# Altium schematic sheet JWpulsegen-V3.SchDoc
size A3
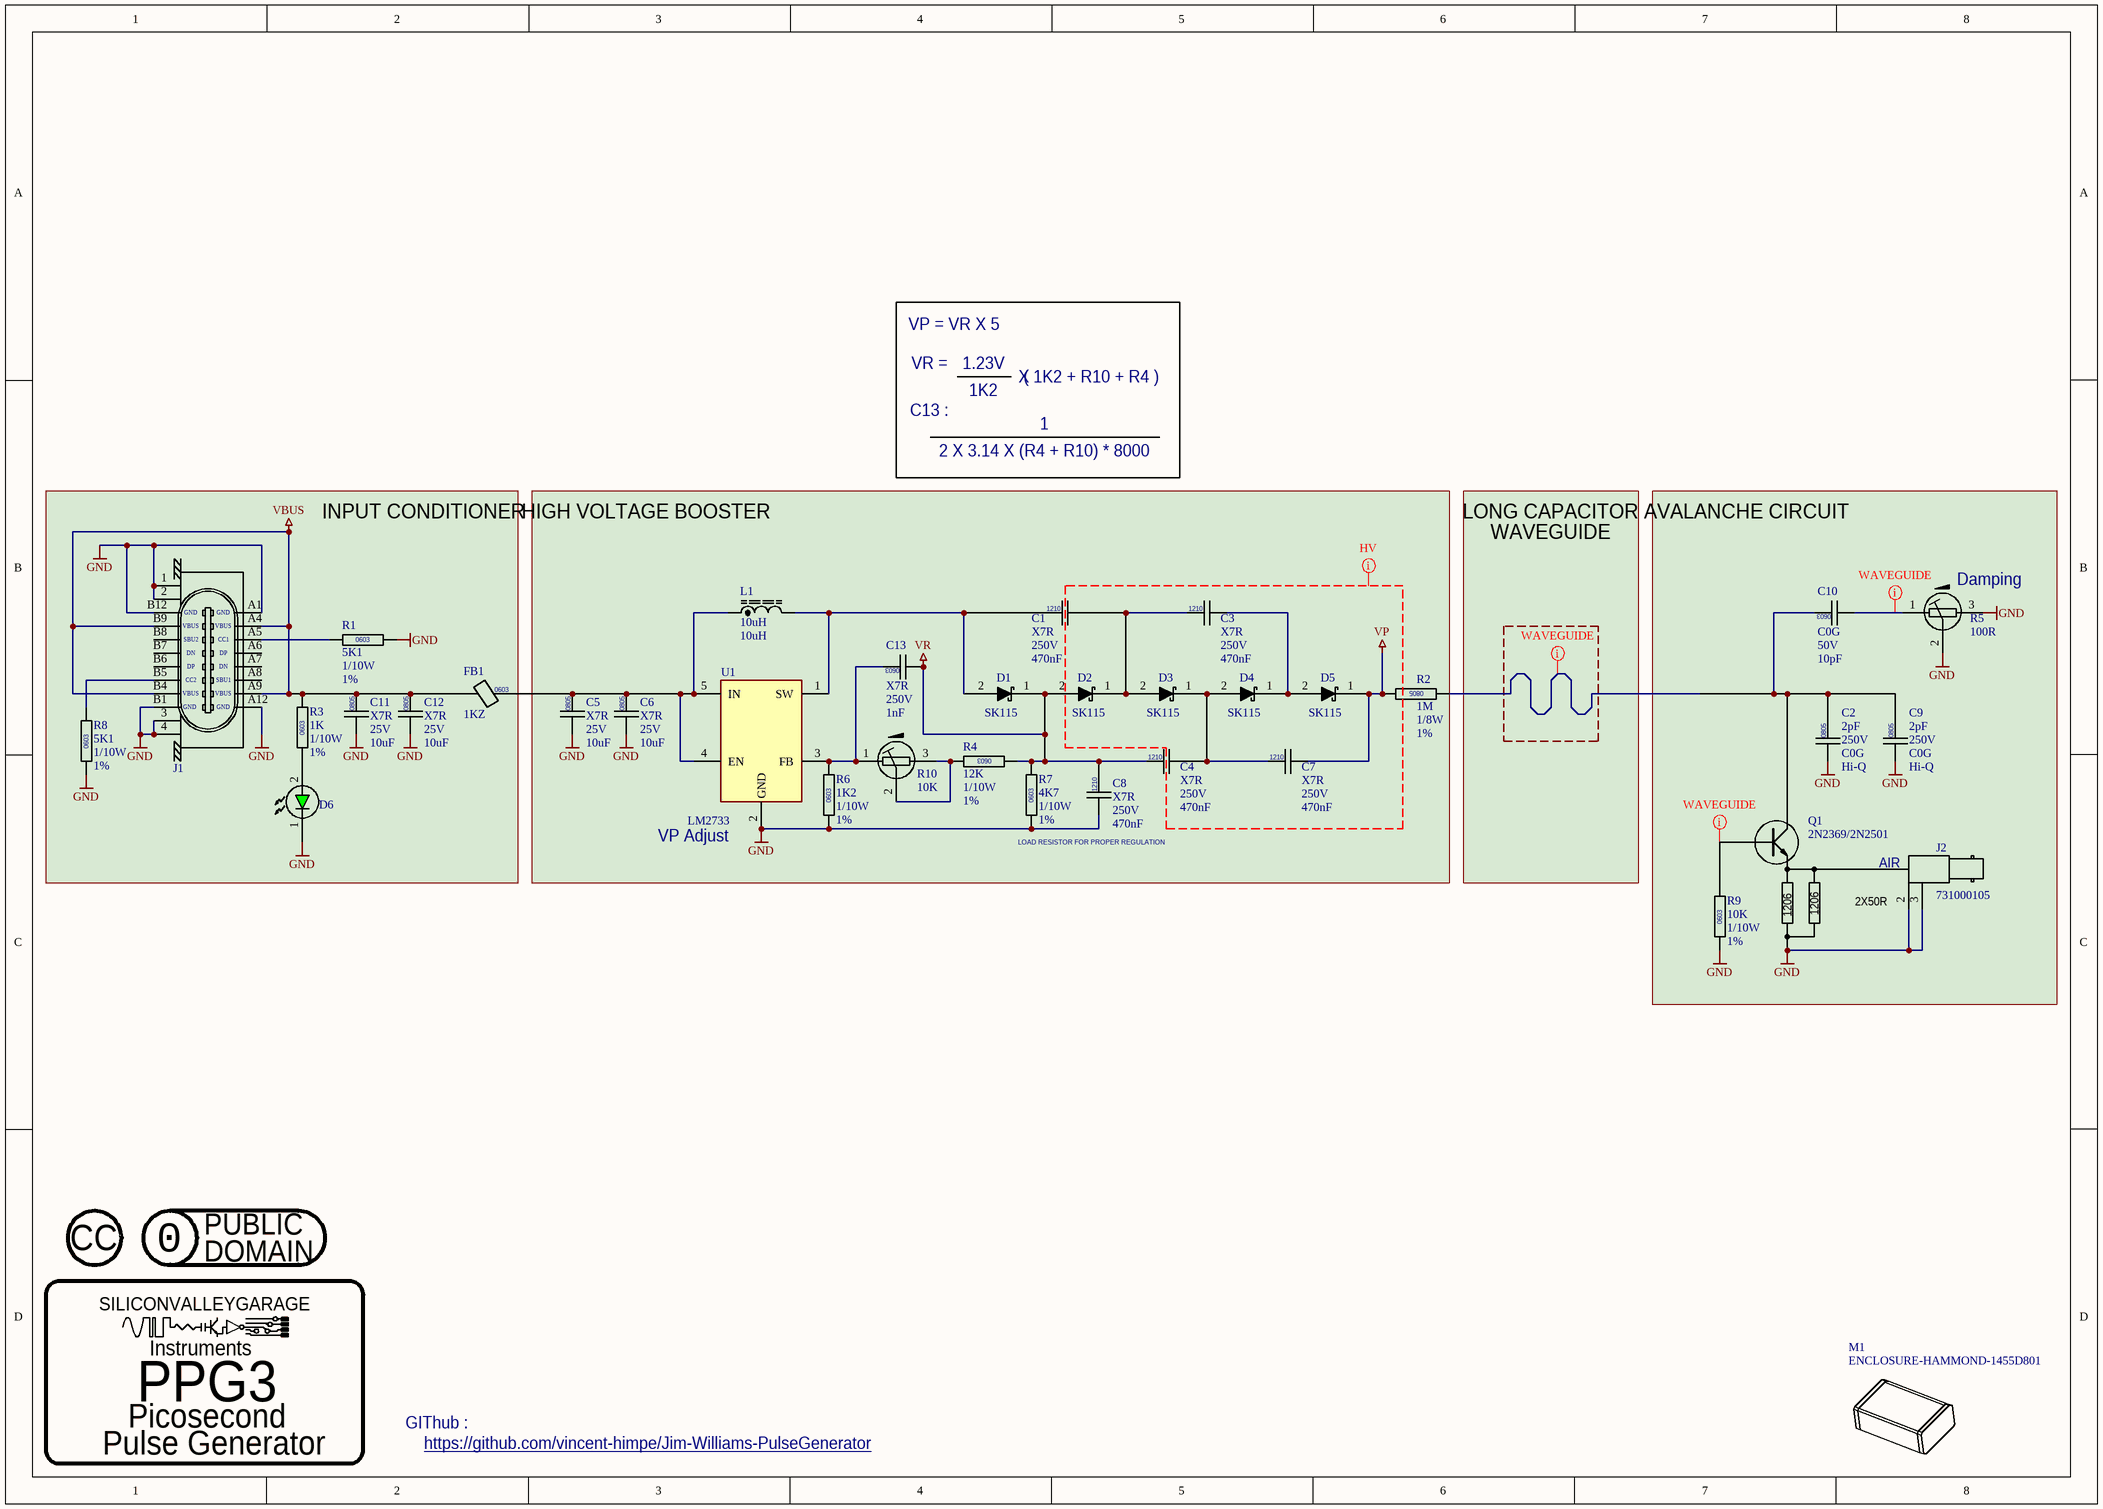
[diagram p0: JWpulsegen-V3.SchDoc]

## Parts
(Parts that share a designator on the sheet are numbered #1, #2 ... from top to bottom, then left to right.)
C1  Dielectric: X7R  Voltage: 250V  Capacitance: 470nF  [CAPC1210]  (hidden comment: CAPC-1210-470nF-250V-X7R)
C2  SPECIAL: Hi-Q  Dielectric: C0G  Voltage: 250V  Capacitance: 2pF  [CAPC0805]  (hidden comment: CAP0805)
C3  Dielectric: X7R  Voltage: 250V  Capacitance: 470nF  [CAPC1210]  (hidden comment: CAPC-1210-470nF-250V-X7R)
C4  Dielectric: X7R  Voltage: 250V  Capacitance: 470nF  [CAPC1210]  (hidden comment: CAPC-1210-470nF-250V-X7R)
C5  Dielectric: X7R  Voltage: 25V  Capacitance: 10uF  [CAPC0805]  (hidden comment: CAP0805)
C6  Dielectric: X7R  Voltage: 25V  Capacitance: 10uF  [CAPC0805]  (hidden comment: CAP0805)
C7  Dielectric: X7R  Voltage: 250V  Capacitance: 470nF  [CAPC1210]  (hidden comment: CAPC-1210-470nF-250V-X7R)
C8  Dielectric: X7R  Voltage: 250V  Capacitance: 470nF  [CAPC1210]  (hidden comment: CAPC-1210-470nF-250V-X7R)
C9  SPECIAL: Hi-Q  Dielectric: C0G  Voltage: 250V  Capacitance: 2pF  [CAPC0805]  (hidden comment: CAP0805)
C10  Dielectric: C0G  Voltage: 50V  Capacitance: 10pF  [CAPC0603]  (hidden comment: CAP0603)
C11  Dielectric: X7R  Voltage: 25V  Capacitance: 10uF  [CAPC0805]  (hidden comment: CAP0805)
C12  Dielectric: X7R  Voltage: 25V  Capacitance: 10uF  [CAPC0805]  (hidden comment: CAP0805)
C13  Dielectric: X7R  Voltage: 250V  Capacitance: 1nF  [CAPC0603]  (hidden comment: CAP0603)
D1  SK115  [DO214AC]
D2  SK115  [DO214AC]
D3  SK115  [DO214AC]
D4  SK115  [DO214AC]
D5  SK115  [DO214AC]
D6  LED-3MM-GREEN  [LED-3MM-GREEN]  (value not drawn)
FB1  value 1KZ  [FB0603]  (hidden comment: FB0603)
J1  CONN-USBC-USB2-HOR  [CONN-GCT-USB4085]  (value not drawn)
J2  731000105  [CONN-MOLEX-7310000105]
L1  10uH  [IND-MURATA-LQH3NPZ]
LOGO?#1  LOGO-LICENSE-CC  [LOGO-LICENSE-CC]  (value not drawn)  (no BOM)
LOGO?#2  LOGO-LICENSE-CC0-PUBLIC  [LOGO-LICENSE-CC0-PUBLIC]  (value not drawn)  (no BOM)
LOGO?#3  LOGO-SILICONVALLEYGARAGE-SMALL  [SILICONVALLEYGARAGE]  (value not drawn)  (graphical)
M1  ENCLOSURE-HAMMOND-1455D801  (mechanical)
Q1  2N2369/2N2501  [SPECIAL-2N2369-JW]
R1  value 5K1  Power: 1/10W  Tolerance: 1%  [RESC0603]  (hidden comment: RESC0603)
R2  value 1M  Power: 1/8W  Tolerance: 1%  [RESC0805]  (hidden comment: RESC0805)
R3  value 1K  Power: 1/10W  Tolerance: 1%  [RESC0603]  (hidden comment: RESC0603)
R4  value 12K  Power: 1/10W  Tolerance: 1%  [RESC0603]  (hidden comment: RESC0603)
R5  value 100R  [TRIMMER-BOURNS-TC33]  (hidden comment: TRIMMER-BOURNS-TC33X-2-101E)
R6  value 1K2  Power: 1/10W  Tolerance: 1%  [RESC0603]  (hidden comment: RESC0603)
R7  value 4K7  Power: 1/10W  Tolerance: 1%  [RESC0603]  (hidden comment: RESC0603)
R8  value 5K1  Power: 1/10W  Tolerance: 1%  [RESC0603]  (hidden comment: RESC0603)
R9  value 10K  Power: 1/10W  Tolerance: 1%  [RESC0603]  (hidden comment: RESC0603)
R10  value 10K  [TRIMMER-BOURNS-TC33]  (hidden comment: TRIMMER-BOURNS-TC33X-2-103G)
U1  LM2733  [SOT23-5]

## Blocks framed on the sheet
INPUT CONDITIONER: C11 C12 D6 FB1 J1 R1 R3 R8
HIGH VOLTAGE BOOSTER: C1 C3-C8 C13 D1-D5 L1 R2 R4 R6 R7 R10 U1
AVALANCHE CIRCUIT: C2 C9 C10 J2 Q1 R5 R9
PPG3: LOGO?#3

## Nets
GND: C2.2 C5.2 C6.2 C8.2 C9.2 C11.2 C12.2 D6.1(A) J1.1 J1.2 J1.3 J1.4 J1.A1 J1.A12 J1.B1 J1.B12 J2.2(VIN) J2.3(VIN) Q1.G R1.1 R5.2 R5.3 R6.2 R7.2 R8.2 R9.2 U1.2(GND)
VBUS: C11.1 C12.1 FB1.2 J1.A4 J1.A9 J1.B4 J1.B9 R3.1
VP: C7.2 D5.1(K) R2.1
VR: C4.1 C8.1 C13.2 D1.1(K) D2.2(A) R4.2 R7.1
NetC1_1: C1.1 D1.2(A) L1.2 U1.1(SW)
NetC1_2: C1.2 C3.1 D2.1(K) D3.2(A)
NetC2_1: C2.1 C9.1 C10.1 Q1.C R2.2
NetC3_2: C3.2 D4.1(K) D5.2(A)
NetC4_2: C4.2 C7.1 D3.1(K) D4.2(A)
NetC5_1: C5.1 C6.1 FB1.1 L1.1 U1.4(EN) U1.5(IN)
NetC10_2: C10.2 R5.1
NetC13_1: C13.1 R6.1 R10.1 U1.3(FB)
NetD6_2: D6.2(K) R3.2
NetJ1_A5: J1.A5 R1.2
NetJ1_B5: J1.B5 R8.1
NetQ1_B: Q1.B R9.1
NetR4_1: R4.1 R10.2 R10.3

Not connected (* = marked no-connect by the designer): J1 A6 A7 A8 B6 B7 B8

## Layout directives
net class WAVEGUIDE: NetC2_1, NetC10_2, NetQ1_B
net class HV: VP

## Notes on the sheet
- VR =
- VP = VR X 5
- 1.23V
- X
- ( 1K2 + R10 + R4 )
- C13 :
- 1K2
- 1
- 2 X 3.14 X (R4 + R10) * 8000
- LONG CAPACITOR
- WAVEGUIDE
- (near R5) Damping
- (near U1) VP Adjust
- LOAD RESISTOR FOR PROPER REGULATION
- (near LOGO?#3) Instruments
- Picosecond
- Pulse Generator
- https://github.com/vincent-himpe/Jim-Williams-PulseGenerator
- GIThub :
- (in symbol CAPC-0805-2pF-250V-C0G-HIQ) 0805
- (in symbol CAPC-0805-10uF-25V) 0805
- (in symbol CAPC-1210-470nF-250V-X7R) 1210
- (in symbol CONN-MOLEX-7310000105) AIR
- (in symbol CONN-USBC-USB2-HOR) GND; VBUS; SBU2; CC1; DN; DP; CC2; SBU1
- (in symbol FB0603-1KZ-0R2) 0603
- (in symbol LOGO-LICENSE-CC) CC
- (in symbol LOGO-LICENSE-CC0-PUBLIC) PUBLIC; 0; DOMAIN
- (in symbol LOGO-SILICONVALLEYGARAGE-SMALL) SILICONVALLEYGARAGE
- (in symbol RESC-0603-1K2-1%-1/10W) 0603
- (in symbol RESC-0603-1K-1%-1/10W) 0603
- (in symbol RESC-0603-4K7-1%-1/10W) 0603
- (in symbol RESC-0603-5K1-1%-1/10W) 0603
- (in symbol RESC-0603-10K-1%-1/10W) 0603
- (in symbol RESC-0603-12K-1%-1/10W) 0603
- (in symbol RESC-0805-1M-1%-1/8W_1) 0805
- (in symbol SPECIAL-2N2369-JW) 1206; 2X50R

## Library data of the parts
C1 C3 C4 C7 C8 = CAPC-1210-470nF-250V-X7R: CAPACITOR,CERAMIC,470nF,250V,X7R,1210; Manufacturer 1: WALSIN; Manufacturer Part Number 1: SH43B474K251CT; Package / Case: 1210 (3225 METRIC); Location: *; Supplier 1: Mouser; Supplier Part Number 1: 80-C1210C474KARACTU; Supplier 2: Digikey; Supplier Part Number 2: 4587-C1210X474K251TCT-ND; Supplier 3: Digikey; Supplier Part Number 3: 4713-CHV1210N250474KXTCT-ND; Supplier 4: Mouser; Supplier Part Number 4: 80-C1210C474KARAUTO; Supplier 5: Mouser; Supplier Part Number 5: 80-C1210X474KARAUTO; MOUSER: 791-SH43B474K251CT
C2 C9 = CAPC-0805-2pF-250V-C0G-HIQ: CAPACITOR,CERAMIC,2pF,250V,C0G,0805,HIQ; Manufacturer 1: JOHANSON; Manufacturer Part Number 1: 251R15S2R0AV4E; Package / Case: 0805 (2012 metric); Location: *; MOUSER: 609-251R15S2R0AV4E
C5 C6 C11 C12 = CAPC-0805-10uF-25V: CAPACITOR,CERAMIC,10uF,25V,X5R,0805; Manufacturer 1: SAMSUNG; Manufacturer Part Number 1: CL21B106KAYQNNE; Package / Case: 0805 (2012 metric); Location: *; LCSC: C3039694; MOUSER: 187-CL21B106KAYQNNE
C10 = CAPC-0603-10PF-50V-C0G: CAPACITOR,CERAMIC,10pF,50V,C0G,0603; Manufacturer 1: KYOCERA; Manufacturer Part Number 1: C0603C100J5GAC; Package / Case: 0603; Location: *; MOUSER: 80-C0603C100J5GAC
C13 = CAPC-0603-1nF-250V-X7R: CAPACITOR,CERAMIC,1nF,250V,X7R,0603; Manufacturer 1: YAGEO; Manufacturer Part Number 1: CC0603KRX7RYBB102; Package / Case: 0603; Location: *; LCSC: C277510; Supplier 1: Digikey; Supplier Part Number 1: 311-4104-1-ND; MOUSER: 603-CC0603KRYBB102
D1-D5 = DIODE-SCHOTTKY-DIOTEC-SK115: DIODE,SCHOTTKY,150V,1A,SK115,DO214AC(SMA); Manufacturer 1: DIOTEC; DIGIKEY: 2796-SK115TR-ND; Manufacturer Part Number 1: SK115; MOUSER: 637-SK115
D6 = LED-3MM-GREEN: LED,TH,GREEN,42mCd,3MM; Manufacturer 1: WURTH; Manufacturer Part Number 1: 151031VS06000; MOUSER: 78-VLMPG33N1P2; Supplier 1: Mouser; Supplier Part Number 1: 78-VLMPG33N1P2
FB1 = FB0603-1KZ-0R2: FERRITE,1KZ@100MHz,0R2DC,0603; Manufacturer 1: MURATA; Manufacturer Part Number 1: BLM18KG102SN1D; LCSC: C160982; Supplier 1: Arrow Electronics; Supplier Part Number 1: BLM18KG102SN1D; MOUSER: 81-BLM18KG102SN1D
J1 = CONN-USBC-USB2-HOR: CONN,USB-C,16P,RA,TH,8.94X9.17; Manufacturer 1: GCT; Manufacturer Part Number 1: USB4085-GF-A; Supplier 1: Digikey; Supplier Part Number 1: 2073-USB4085-GF-ACT-ND; LCSC: C7095263; MOUSER: 640-USB4085-GF-A
J2 = CONN-MOLEX-7310000105: CONN,BNC,RA; Manufacturer 1: MOLEX; Manufacturer Part Number 1: 731000-0105; DIGIKEY: WM5524-ND; MOUSER: 538-73100-0105
L1 = IND-MURATA-LQH3NPZ100MMEL: IND,10uH,1.2A,3X3, LQH3NPZ100MMEL; Manufacturer 1: MURATA; LCSC: C701168; Supplier 1: Arrow Electronics; Supplier Part Number 1: LQH3NPZ100MMEL; VALUE: 10uH; Manufacturer Part Number 1: LQH3NPZ100MMEL; MOUSER: 81-LQH3NPZ100MMEL
LOGO?#3 = LOGO-SILICONVALLEYGARAGE-SMALL: LOGO,SILICONVALLEYGARAGE,SMALL
M1 = ENCLOSURE-HAMMOND-1455D801: ENCLOSURE,ALU.EXTRUDED,3.2inX1.8inX0.99in; Manufacturer 1: HAMMOND MANUFACTURING; Manufacturer Part Number 1: 1455D801; MOUSER: 546-1455D801
Q1 = SPECIAL-2N2369-JW: TRANSISTOR, 2N2369 OR 2N2501, GOLD PINS, NOT 'A' VERSION; Manufacturer 1: SELECTED; Supplier 1: Mouser; Supplier Part Number 1: 610-2N2369A; Manufacturer Part Number 1: SELECTED; MOUSER: SELECTED
R1 R8 = RESC-0603-5K1-1%-1/10W: RESISTOR,5K1,1%,100mW,0603 (1608); Manufacturer 1: YAGEO; Manufacturer Part Number 1: RC0603FR-075K1L; Location: *; LCSC: C105580; MOUSER: 603-RC0603FR-075K1
R2 = RESC-0805-1M-1%-1/8W_1: RESISTOR,1M,1%,125mW,0805; Manufacturer 1: VISHAY; Manufacturer Part Number 1: RCV08051M00FKEA; Location: *; Parameter 4: *; MOUSER: 71-RCV08051M00FKEA
R3 = RESC-0603-1K-1%-1/10W: RESISTOR,1K,1%,100mW,0603 (1608); Manufacturer 1: YAGEO; Manufacturer Part Number 1: RC0603FR-071KL; Location: *; LCSC: C22548; MOUSER: 603-RC0603FR-071KL
R4 = RESC-0603-12K-1%-1/10W: RESISTOR,12K,1%,100mW,0603 (1608); Manufacturer 1: STACKPOLE; Manufacturer Part Number 1: RMCF0603FT12K0; Location: *; Supplier 1: Digikey; Supplier Part Number 1: RMCF0603FT12K0CT-ND; Supplier 2: Digikey; Supplier Part Number 2: 2019-RK73H1JTTD1202FCT-ND; Supplier 3: Avnet; Supplier Part Number 3: 73AC9048; MOUSER: 708-RMCF0603FT12K0; Supplier 4: Digikey; Supplier Part Number 4: 13-AC0603FR-1012KLCT-ND
R5 = TRIMMER-BOURNS-TC33X-2-101E: RES,TRIM,SMD,100R; Manufacturer 1: BOURNS; Manufacturer Part Number 1: TC33X-2-101E; MOUSER: 652-TC33X-2-101E
R6 = RESC-0603-1K2-1%-1/10W: RESISTOR,1K2,1%,100mW,0603 (1608); Manufacturer 1: STACKPOLE; Manufacturer Part Number 1: RMCF0603FT1K20; Location: *; Supplier 1: Digikey; Supplier Part Number 1: RMCF0603FT12K0CT-ND; Supplier 2: Digikey; Supplier Part Number 2: 2019-RK73H1JTTD1202FCT-ND; Supplier 3: Avnet; Supplier Part Number 3: 73AC9048; Supplier 4: Digikey; Supplier Part Number 4: 13-AC0603FR-1012KLCT-ND; MOUSER: 708-RMCF0603FT1K20
R7 = RESC-0603-4K7-1%-1/10W: RESISTOR,4K7,1%,100mW,0603 (1608); Manufacturer 1: YAGEO; Manufacturer Part Number 1: RC0603FR-074K7L; Location: *; LCSC: C99782; MOUSER: 603-RC0603FR-074K7L; Supplier 1: Future Electronics; Supplier Part Number 1: 5489695; Supplier 2: Digikey; Supplier Part Number 2: P4.70KHCT-ND; Supplier 3: Digikey; Supplier Part Number 3: RMCF0603FT4K70CT-ND; Supplier 4: Avnet; Supplier Part Number 4: 1622960-1
R9 = RESC-0603-10K-1%-1/10W: RESISTOR,10K,1%,100mW,0603 (1608); Manufacturer 1: YAGEO; Manufacturer Part Number 1: RC0603FR-0710KL; Location: *; Supplier 1: Future Electronics; Supplier Part Number 1: 4023214; Supplier 2: Digikey; Supplier Part Number 2: RMCF0603FT10K0CT-ND; Supplier 3: Mouser; Supplier Part Number 3: 667-ERJ-3EKF1002V; LCSC: C98220; MOUSER: 603-RC0603FR-0710KL
R10 = TRIMMER-BOURNS-TC33X-2-103G: RES,TRIM,SMD,10K; Manufacturer 1: BOURNS; Manufacturer Part Number 1: TC33X-2-103G; MOUSER: 652-TC33X-2-103G
U1 = IC-TI-LM2733: PMIC,BOOST,LM2733,600KHz,SOT23-5; Manufacturer 1: TI; Manufacturer Part Number 1: LM2733YMFX/NOPB; Location: *; Supplier 1: Mouser; Supplier Part Number 1: 926-LM2733YMF/NOPB; Supplier 2: Mouser; Supplier Part Number 2: 926-LM2733XMF/NOPB; Supplier 3: Arrow Electronics; Supplier Part Number 3: LM2733XMF; Supplier 4: Mouser; Supplier Part Number 4: 926-LM2733XMFX/NOPB; Supplier 5: Mouser; Supplier Part Number 5: 926-LM2733YMF; Supplier 6: Bison Technologies; Supplier Part Number 6: LM2733XMFX-256963; MOUSER: 926-LM2733YMFX/NOPB